# Altium schematic sheet BlockDiagram.SchDoc: Wireless control
size A3; Date: 3; CompanyName: mert; DocumentNumber: 1; SheetNumber: 1; SheetTotal: 4
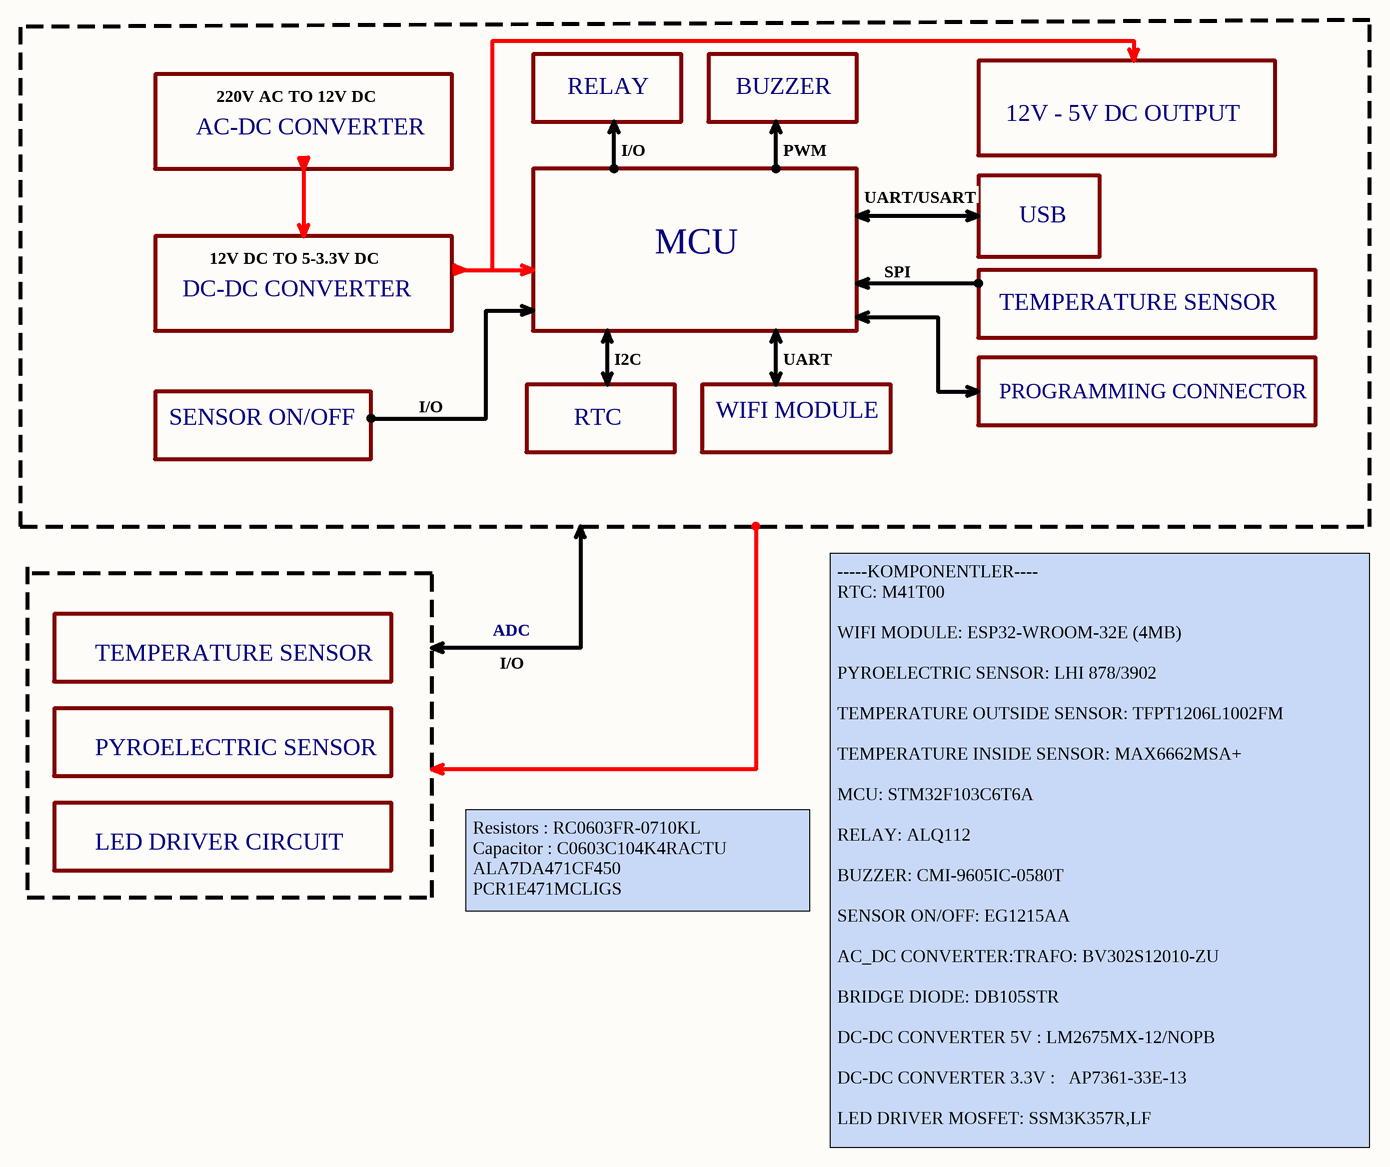
[diagram p0: BlockDiagram.SchDoc]

## Notes on the sheet
- 220V AC TO 12V DC
- RELAY
- BUZZER
- AC-DC CONVERTER
- I/O
- PWM
- 12V - 5V DC OUTPUT
- UART/USART
- USB
- DC-DC CONVERTER
- 12V DC TO 5-3.3V DC
- MCU
- SPI
- TEMPERATURE SENSOR
- I2C
- UART
- SENSOR ON/OFF
- RTC
- WIFI MODULE
- PROGRAMMING CONNECTOR
- ADC
- PYROELECTRIC SENSOR
- LED DRIVER CIRCUIT
- Resistors : RC0603FR-0710KL                    Capacitor : C0603C104K4RACTU
  ALA7DA471CF450
  PCR1E471MCLIGS
- -----KOMPONENTLER----
  RTC: M41T00
  WIFI MODULE: ESP32-WROOM-32E (4MB)
  PYROELECTRIC SENSOR: LHI 878/3902
  TEMPERATURE OUTSIDE SENSOR: TFPT1206L1002FM
  TEMPERATURE INSIDE SENSOR: MAX6662MSA+
  MCU: STM32F103C6T6A
  RELAY: ALQ112
  BUZZER: CMI-9605IC-0580T
  SENSOR ON/OFF: EG1215AA
  AC_DC CONVERTER:TRAFO: BV302S12010-ZU
  BRIDGE DIODE: DB105STR
  DC-DC CONVERTER 5V : LM2675MX-12/NOPB
  DC-DC CONVERTER 3.3V :   AP7361-33E-13
  LED DRIVER MOSFET: SSM3K357R,LF